# EAGLE design screen board (EAGLE 9.0.0)
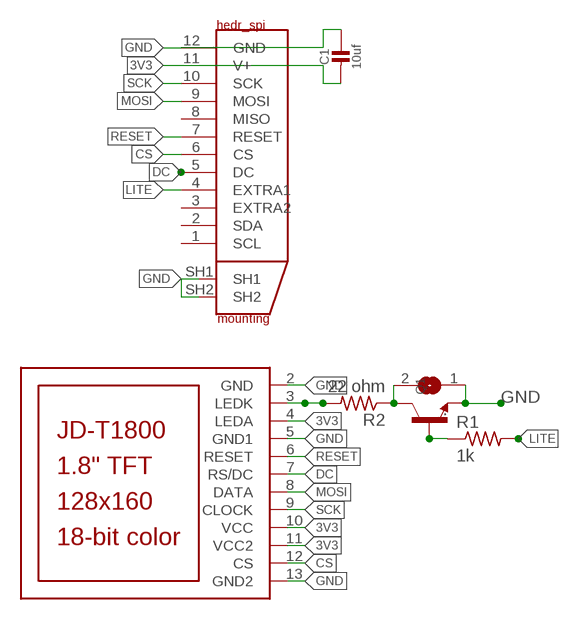
[diagram p0: schematic, sheet 1]

## Parts
.  JUMPER_OPEN  [SOLDERJUMPER_ARROW_NOPASTE]
..  HEDR-SPI-PFC_12SLAVE_EXTEN  [FPC_TE_1-1734839-2_EXTENDED]
C1  10uf  C-US_0805-NOTHERMALS  [MICROBUILDER_0805_NOTHERMALS]
LCD2  TFT-1.8-JD-T1800-_NO_DRILL_WRAP  [0TG-LIB-V01.1_JD-T1800-REV-WRAP_NO-DRILL]
Q1  TRANSISTOR_NPNWIDE  [SOT23-WIDE]
R1  1k  R-US_R0805  [R0805]
R2  22 ohm  R-US_R0805  [R0805]

## Nets
3V3: ...11(V+) C1.2 LCD2.4(LEDA) LCD2.10(VCC) LCD2.11(VCC2)
CS: ...6(CS) LCD2.12(CS)
DC: ...5(DC) LCD2.7(RS/DC)
GND: ..1 ...12(GND) ...SH1 ...SH2 C1.1 LCD2.2(GND) LCD2.5(GND1) LCD2.13(GND2) Q1.2(E)
LITE: ...4(EXTRA1) R1.2
MOSI: ...9(MOSI) LCD2.8(DATA)
N$1: Q1.1(B) R1.1
N$2: LCD2.3(LEDK) R2.2
N$3: ..2 Q1.3(C) R2.1
RESET: ...7(RESET) LCD2.6(RESET)
SCK: ...10(SCK) LCD2.9(CLOCK)
Unconnected: ...1(SCL) ...2(SDA) ...3(EXTRA2) ...8(MISO)

## Library data of the parts
. = 0TG-Lib v01.2:JUMPER_OPEN: SMD Solder JUMPER from: microbuilder Solder the two pads together to create a connection, or remove the solder to break it. REFLOW - Use this footprint for solder paste and reflow ovens. WAVE - Use this footprint for hand-soldering (larger pads). CLOSED - Has a trace between the two pads to ensure it is closed by default. The trace needs to be cut to disable the jumper, and can be closed again by creating a solder bridge between the two pads.; BOM: EXCLUDE
.. = 0TG-Lib v01.1:HEDR-SPI-PFC_12
C1 = 0TG-Lib v01.1:C-US_: from: microbuilder Ceramic Capacitors For new designs, use the packages preceded by an '_' character since they are more reliable: The following footprints should be used on most boards: _0402 - Standard footprint for regular board layouts _0603 - Standard footprint for regular board layouts _0805 - Standard footprint for regular board layouts _1206 - Standard footprint for regular board layouts For extremely tight-pitch boards where space is at a premium, the following 'micro-pitch' footprints can be used (smaller pads, no silkscreen outline, etc.): _0402MP - Micro-pitch footprint for very dense/compact boards _0603MP - Micro-pitch footprint for very dense/compact boards _0805MP - Micro-pitch footprint for very dense/compact boards _1206MP - Micro-pitch footprint for very dense/compact boards
LCD2 = 0TG-Lib v01.2:TFT-1.8-JD-T1800-: derived from: adafruit
Q1 = 0TG-Lib v01.1:TRANSISTOR_NPN: NPN Transistor Transistor (NPN) 500mA 45V - BC817 [Digikey: 568-1631-1-ND] Transistor (NPN) 500mA 45V - BC817,215 [Mouser: 771-BC817-T/R] SOT23-R - SOT23 footprint optimised for use with solder paste and reflow ovens. SOT23-W - SOT23 footprint optimised for hand-soldering (larger pads). from: microbuilder
R1 R2 = 0TG-Lib v01.1:R-US_: from: eaglecad RESISTOR, American symbol; SPICEPREFIX: R

## Board
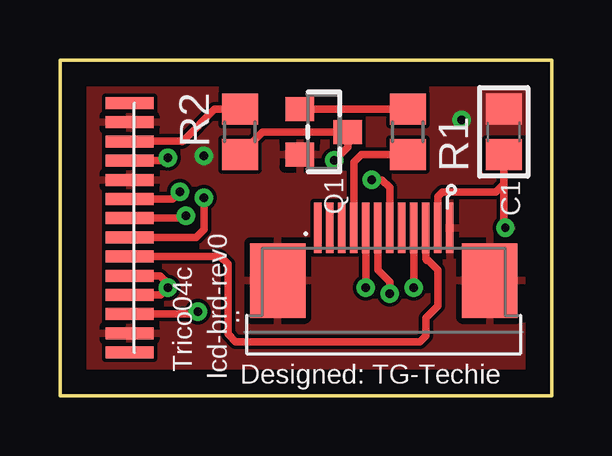
[diagram p1: board, top side]
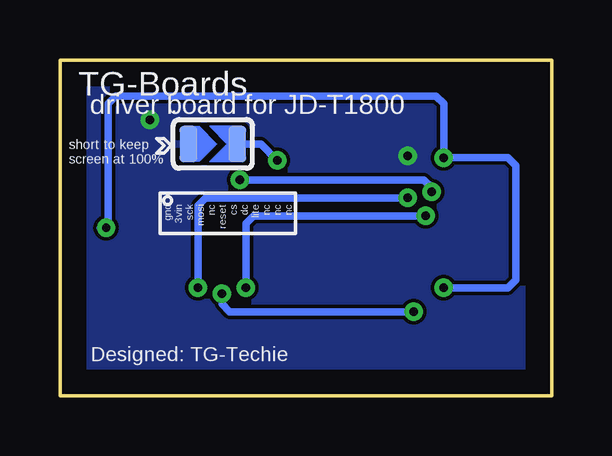
[diagram p2: board, bottom side, seen from below]

Size 20.5 x 14 mm. Coordinates in mm from the lower left corner, seen from the top.
Outline: 0,14 0,0 20.5,0 20.5,14 0,14
Copper layers (1*16): Top 0.035mm / dielectric 1.5mm / Bottom 0.035mm
Design rules "default": minimum track width 6mil, minimum drill 0.35mm, track to track 6mil, track to pad 6mil, pad to pad 6mil, via to via 6mil, smd to smd 6mil, copper to edge 40mil, drill to drill 6mil, minimum pad ring 10mil, minimum via ring 8mil, stop-mask expansion 4mil, vias tented up to drill 0mil, thermal gap 10mil

### Footprints (pad centres in the part's own frame; a part is rotated, then mirrored left to right if it is on the bottom)
SOLDERJUMPER_ARROW_NOPASTE = smd 0.762 x 1.524: 1 -1.016,0; 2 1.016,0
FPC_TE_1-1734839-2_EXTENDED = smd 0.3 x 2.1: 1 -2.75,0.5; 2 -2.25,0.5; 3 -1.75,0.5; 4 -1.25,0.5; 5 -0.75,0.5; 6 -0.25,0.5; 7 0.25,0.5; 8 0.75,0.5; 9 1.25,0.5; 10 1.75,0.5; 11 2.25,0.5; 12 2.75,0.5 | smd 2.3 x 3.1: SH1 -4.42,-1.7; SH2 4.42,-1.7
MICROBUILDER_0805_NOTHERMALS = smd 1.3 x 1.5: 1 -0.95,0; 2 0.95,0
0TG-LIB-V01.1_JD-T1800-REV-WRAP_NO-DRILL = smd 0.5 x 2 bottom: 1 5.2,-13.1; 2 4.4,-13.1; 3 3.6,-13.1; 4 2.8,-13.1; 5 2,-13.1; 6 1.2,-13.1; 7 0.4,-13.1; 8 -0.4,-13.1; 9 -1.2,-13.1; 10 -2,-13.1; 11 -2.8,-13.1; 12 -3.6,-13.1; 13 -4.4,-13.1; 14 -5.2,-13.1
SOT23-WIDE = smd 1 x 1.2: 1 -0.95,-1; 2 0.95,-1; 3 0,1
R0805 = smd 1.3 x 1.5: 1 -0.95,0; 2 0.95,0

### Placement (x,y rotation side)
.  14.12,10.5 0 bottom
..  13.5,6.5 0 top
C1  18.5,11 270 top
LCD2  16,7 90 bottom
Q1  11,11 270 top
R1  14.5,11 270 top
R2  7.5,11 90 top

### Tracks (layer width: path | path; a pad name or v marks a point on that pad's centre or on a via)
3V3  (via drill 0.35)
  Top 0.305: ...11 15.75,8.31 15.94,8.5 18.18,8.5 18.5,8.82 C1.2 18.5,7.32 18.82,7 v18.57,7 | LCD2.10 4.18,5 4.5,4.68 v4.5,4.5 4.2,4.2 LCD2.11 | LCD2.4 4.38,9.8 v4.5,9.92
  Bottom 0.305: v18.57,7 18.82,7 18.5,7.32 18.5,12.18 18.18,12.5 4.82,12.5 4.5,12.18 v4.5,9.92 1.82,9.92 1.5,9.6 1.5,4.82 1.82,4.5 v4.5,4.5
CS  (via drill 0.35)
  Top 0.305: v5.75,3.5 5.65,3.4 LCD2.12 | v13.75,4.25 13.75,4.75 13.25,5.25 ...6
  Bottom 0.305: v5.75,3.5 13.43,3.5 13.75,3.82 v13.75,4.25
DC  (via drill 0.35)
  Top 0.305: v12.75,4.5 ...5 | v5.25,7.5 5.15,7.4 LCD2.7
  Bottom 0.305: v5.25,7.5 12.43,7.5 12.75,7.18 v12.75,4.5
GND  (via drill 0.35)
  Bottom 0.305: 15.1,11.03 15.1,10.54 ..1
  other vias: 6,10 16.75,11.5
  pour Bottom: -1,-1 -1,15 21.5,15 21.5,-1
  pour Top: -0.5,-0.5 21,-0.5 21,14.5 -0.5,14.5
LITE
  Top 0.305: ...4 12.25,9.73 12.57,10.05 13.73,10.05 R1.2
MOSI  (via drill 0.35)
  Top 0.305: v6,8.25 6,6.92 5.68,6.6 LCD2.8 | v14.75,4.5 ...9
  Bottom 0.305: v6,8.25 14.43,8.25 14.75,7.93 v14.75,4.5
N$1
  Top 0.305: Q1.1 R1.1
N$2
  Top 0.305: R2.2 6.45,11.95 5.12,10.62 | 5.12,10.62 5.1,10.6 | 5.12,10.62 2.93,10.62 LCD2.3
N$3  (via drill 0.35)
  Top 0.305: R2.1 8.45,11 Q1.3 12,10.37 v11.44,9.81
  Bottom 0.305: ..2 12.12,10.5 v11.44,9.81
RESET  (via drill 0.35)
  Top 0.305: ...7 13.75,8.68 13.43,9 v13,9 | v5,8.5 4.7,8.2 LCD2.6
  Bottom 0.305: v13,9 5.32,9 5,8.68 v5,8.5
SCK
  Top 0.305: ...10 15.25,5.69 15.3,5.64 15.36,5.64 15.75,5.25 15.75,3.75 15.25,3.25 15.25,2.5 15,2.25 7.32,2.25 7,2.57 7,5.48 6.68,5.8 LCD2.9 2.55,5.8 2.5,5.75

### Text on the board
tPlace: Trico04c | lcd-brd-rev0 | Designed: TG-Techie
bPlace: driver board for JD-T1800 | TG-Boards | short to keep / screen at 100% | gnd / 3vin / sck / mosi / nc / reset / cs / dc / lite / nc / nc / nc | Designed: TG-Techie